# EAGLE design metercam (EAGLE 9.6.2)
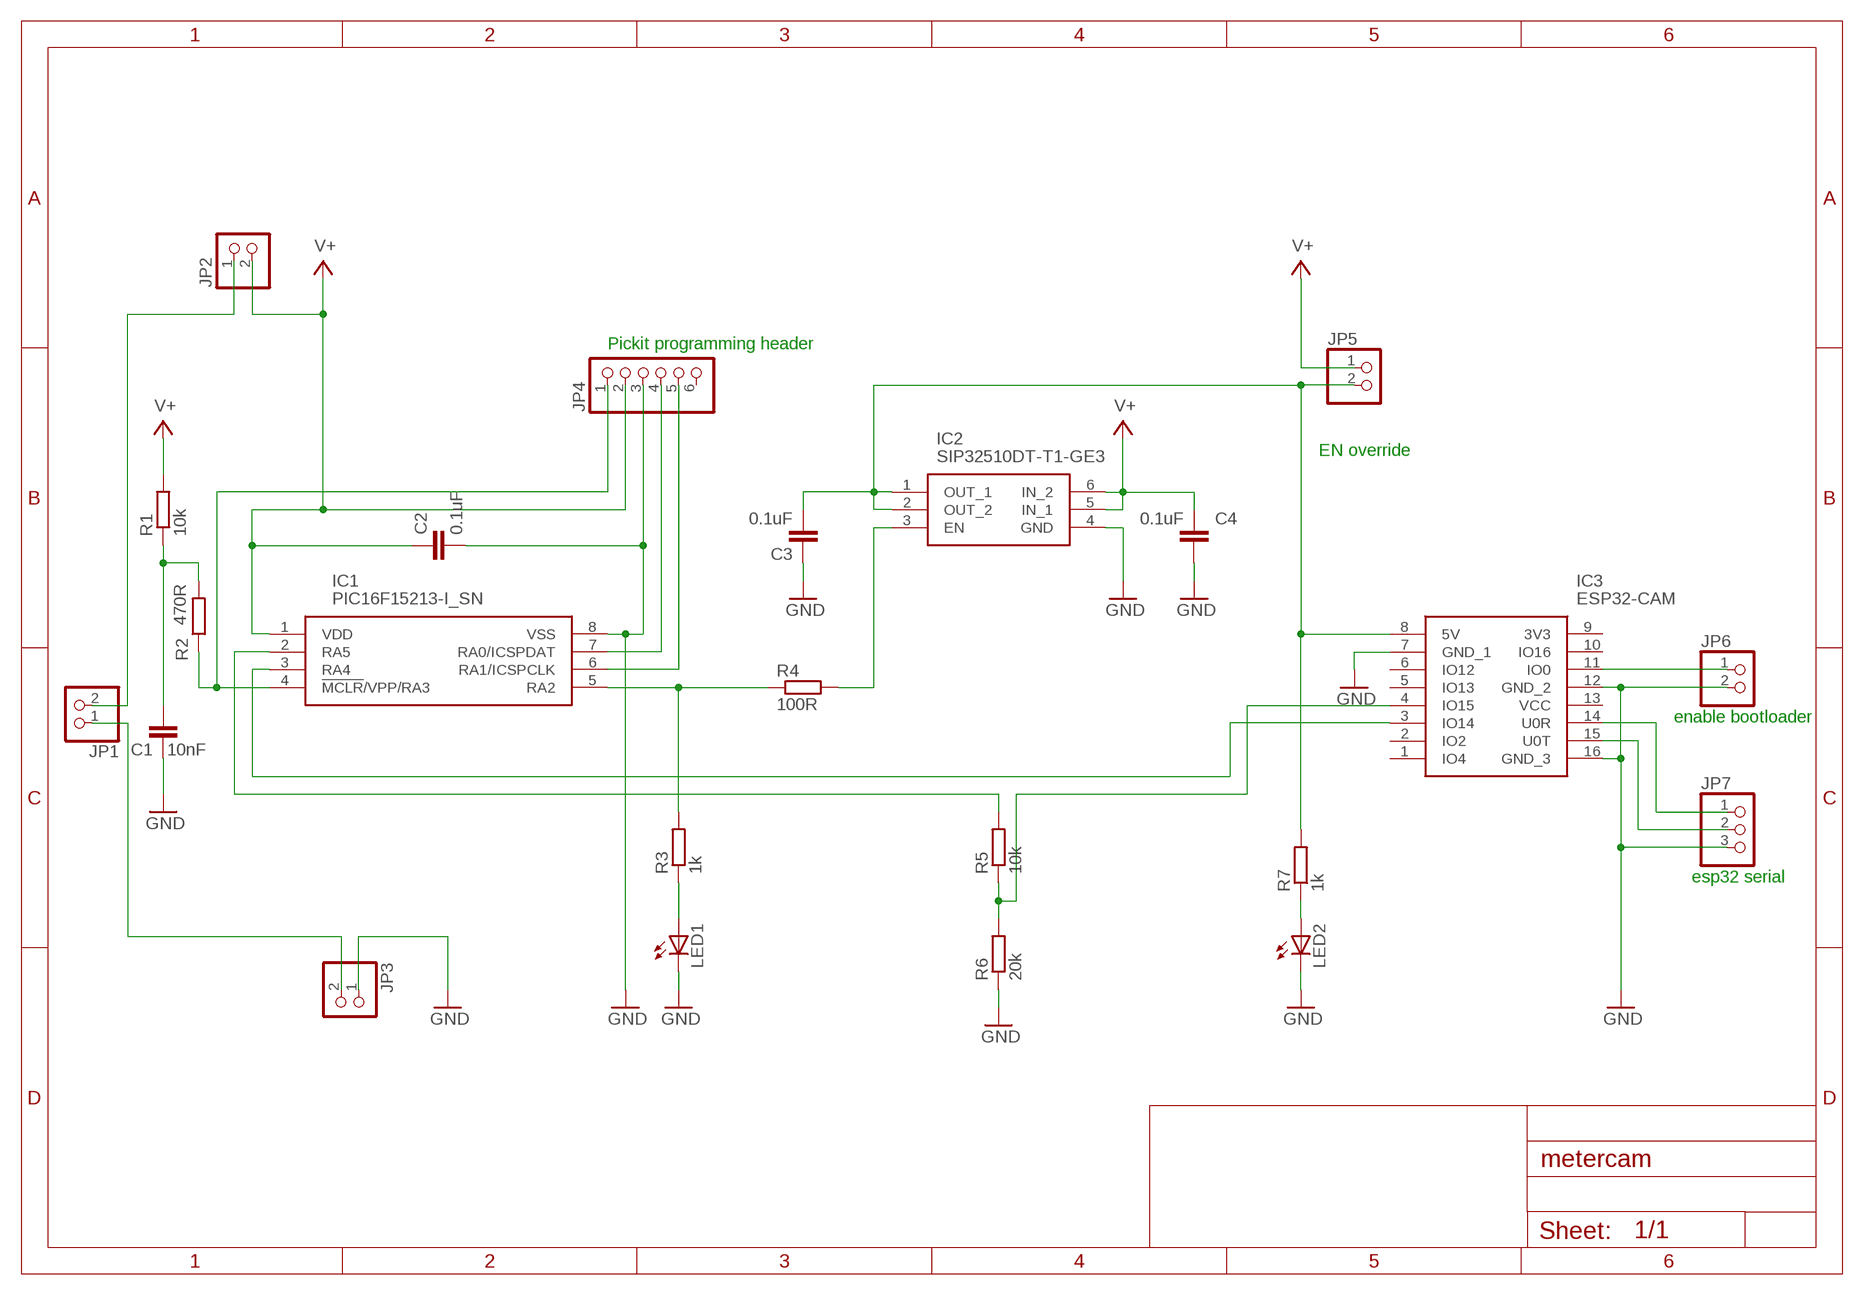
[diagram p0: schematic, sheet 1]

## Parts
C1  10nF  C-EUC0805  [C0805]
C2  0.1uF  C-EUC0805  [C0805]
C3  0.1uF  C-EUC0805  [C0805]
C4  0.1uF  C-EUC0805  [C0805]
IC1  PIC16F15213-I_SN  [SOIC127P600X175-8N]
IC2  SIP32510DT-T1-GE3  [SOT95P284X110-6N]
IC3  ESP32-CAM  [ESP32CAM]
JP1  PINHD-1X2  [1X02]
JP2  PINHD-1X2  [1X02]
JP3  PINHD-1X2  [1X02]
JP4  PINHD-1X6  [1X06]
JP5  PINHD-1X2  [1X02]
JP6  PINHD-1X2  [1X02]
JP7  PINHD-1X3  [1X03]
LED1  LEDSML0805  [SML0805]
LED2  LEDSML0805  [SML0805]
R1  10k  R-EU_R0805  [R0805]
R2  470R  R-EU_R0805  [R0805]
R3  1k  R-EU_R0805  [R0805]
R4  100R  R-EU_R0805  [R0805]
R5  10k  R-EU_R0805  [R0805]
R6  20k  R-EU_R0805  [R0805]
R7  1k  R-EU_R0805  [R0805]

## Nets
GND: C1.1 C2.2 C3.1 C4.1 IC1.8(VSS) IC2.4(GND) IC3.7(GND_1) IC3.12(GND_2) IC3.16(GND_3) JP3.1 JP4.3 JP6.2 JP7.3 LED1.C LED2.C R6.1
N$1: IC1.4(!MCLR!/VPP/RA3) JP4.1 R2.1
N$2: IC3.14(U0R) JP7.1
N$3: JP1.2 JP2.1
N$4: IC1.7(RA0/ICSPDAT) JP4.4
N$5: IC1.6(RA1/ICSPCLK) JP4.5
N$6: IC3.11(IO0) JP6.1
N$7: JP1.1 JP3.2
N$8: IC3.15(U0T) JP7.2
N$9: IC1.5(RA2) R3.2 R4.1
N$10: IC2.3(EN) R4.2
N$11: C3.2 IC2.1(OUT_1) IC2.2(OUT_2) IC3.8(5V) JP5.2 R7.2
N$12: LED2.A R7.1
N$13: LED1.A R3.1
N$14: IC1.3(RA4) IC3.3(IO14)
N$15: IC1.2(RA5) R5.2
N$16: IC3.4(IO15) R5.1 R6.2
N$17: C1.2 R1.1 R2.2
V+: C2.1 C4.2 IC1.1(VDD) IC2.5(IN_1) IC2.6(IN_2) JP2.2 JP4.2 JP5.1 R1.2
Unconnected: IC3.1(IO4) IC3.2(IO2) IC3.5(IO13) IC3.6(IO12) IC3.9(3V3) IC3.10(IO16) IC3.13(VCC) JP4.6

## Notes on the sheet
- Pickit programming header
- EN override
- enable bootloader
- esp32 serial

## Library data of the parts
C1-C4 = rcl:C-EU: CAPACITOR, European symbol
IC1 = SamacSys_Parts:PIC16F15213-I_SN: 8-bit Microcontrollers - MCU Source: Datasheet <https://ww1.microchip.com/downloads/en/DeviceDoc/PIC16F15213-14-23-24-43-44-Data-Sheet-DS40002195B.pdf>; DESCRIPTION: 8-bit Microcontrollers - MCU; HEIGHT: 1.75mm; MANUFACTURER_NAME: Microchip; MANUFACTURER_PART_NUMBER: PIC16F15213-I/SN; MOUSER_PART_NUMBER: 579-PIC16F15213-I/SN; MOUSER_PRICE-STOCK: https://www.mouser.co.uk/ProductDetail/Microchip-Technology/PIC16F15213-I-SN/?qs=xZ%2FP%252Ba9zWqYiVkzeoDlM6Q%3D%3D
IC2 = SamacSys_Parts:SIP32510DT-T1-GE3: VISHAY - SIP32510DT-T1-GE3 - IC, LOAD SWITCH, 1.1V-5.5V, 3A, TSOT-23 Source: Datasheet <http://www.vishay.com/docs/63577/sip32510.pdf>; DESCRIPTION: VISHAY - SIP32510DT-T1-GE3 - IC, LOAD SWITCH, 1.1V-5.5V, 3A, TSOT-23; HEIGHT: 1.1mm; MANUFACTURER_NAME: Vishay; MANUFACTURER_PART_NUMBER: SIP32510DT-T1-GE3; MOUSER_PART_NUMBER: 78-SIP32510DT-T1-GE3; MOUSER_PRICE-STOCK: https://www.mouser.co.uk/ProductDetail/Vishay-Siliconix/SIP32510DT-T1-GE3?qs=vCSEJkzpMViCK9YFQ975Xw%3D%3D
IC3 = ESP32-CAM:ESP32-CAM: Modules PCBA Module RoHS Source: Datasheet <https://datasheet.lcsc.com/szlcsc/Ai-Thinker-ESP32-CAM_C277946.pdf>; DESCRIPTION: Modules PCBA Module RoHS; HEIGHT: 5mm; MANUFACTURER_NAME: Ai-Thinker; MANUFACTURER_PART_NUMBER: ESP32-CAM
JP1-JP3 JP5 JP6 = pinhead:PINHD-1X2: PIN HEADER
JP4 = pinhead:PINHD-1X6: PIN HEADER
JP7 = pinhead:PINHD-1X3: PIN HEADER
LED1 LED2 = led:LED: LED OSRAM: - CHIPLED LG R971, LG N971, LY N971, LG Q971, LY Q971, LO R971, LY R971 LH N974, LH R974 LS Q976, LO Q976, LY Q976 LO Q996 - Hyper CHIPLED LW Q18S LB Q993, LB Q99A, LB R99A - SideLED LS A670, LO A670, LY A670, LG A670, LP A670 LB A673, LV A673, LT A673, LW A673 LH A674 LY A675 LS A676, LA A676, LO A676, LY A676, LW A676 LS A679, LY A679, LG A679 - Hyper Micro SIDELED® LS Y876, LA Y876, LO Y876, LY Y876 LT Y87S - SmartLED LW L88C, LW L88S LB L89C, LB L89S, LG L890 LS L89K, LO L89K, LY L89K LS L896, LA L896, LO L896, LY L896 - TOPLED LS T670, LO T670, LY T670, LG T670, LP T670 LSG T670, LSP T670, LSY T670, LOP T670, LYG T670 LG T671, LOG T671, LSG T671 LB T673, LV T673, LT T673, LW T673 LH T674 LS T676, LA T676, LO T676, LY T676, LB T676, LH T676, LSB T676, LW T676 LB T67C, LV T67C, LT T67C, LS T67K, LO T67K, LY T67K, LW E67C LS E67B, LA E67B, LO E67B, LY E67B, LB E67C, LV E67C, LT E67C LW T67C LS T679, LY T679, LG T679 LS T770, LO T770, LY T770, LG T770, LP T770 LB T773, LV T773, LT T773, LW T773 LH T774 LS E675, LA E675, LY E675, LS T675 LS T776, LA T776, LO T776, LY T776, LB T776 LHGB T686 LT T68C, LB T68C - Hyper Mini TOPLED® LB M676 - Mini TOPLED Santana® LG M470 LS M47K, LO M47K, LY M47K Source: http://www.osram.convergy.de LUXEON: - LUMILED® LXK2-PW12-R00, LXK2-PW12-S00, LXK2-PW14-U00, LXK2-PW14-V00 LXK2-PM12-R00, LXK2-PM12-S00, LXK2-PM14-U00 LXK2-PE12-Q00, LXK2-PE12-R00, LXK2-PE12-S00, LXK2-PE14-T00, LXK2-PE14-U00 LXK2-PB12-K00, LXK2-PB12-L00, LXK2-PB12-M00, LXK2-PB14-N00, LXK2-PB14-P00, LXK2-PB14-Q00 LXK2-PR12-L00, LXK2-PR12-M00, LXK2-PR14-Q00, LXK2-PR14-R00 LXK2-PD12-Q00, LXK2-PD12-R00, LXK2-PD12-S00 LXK2-PH12-R00, LXK2-PH12-S00 LXK2-PL12-P00, LXK2-PL12-Q00, LXK2-PL12-R00 Source: www.luxeon.com KINGBRIGHT: KA-3528ASYC Source: www.kingbright.com
R1-R7 = resistor:R-EU_: RESISTOR, European symbol

## Board
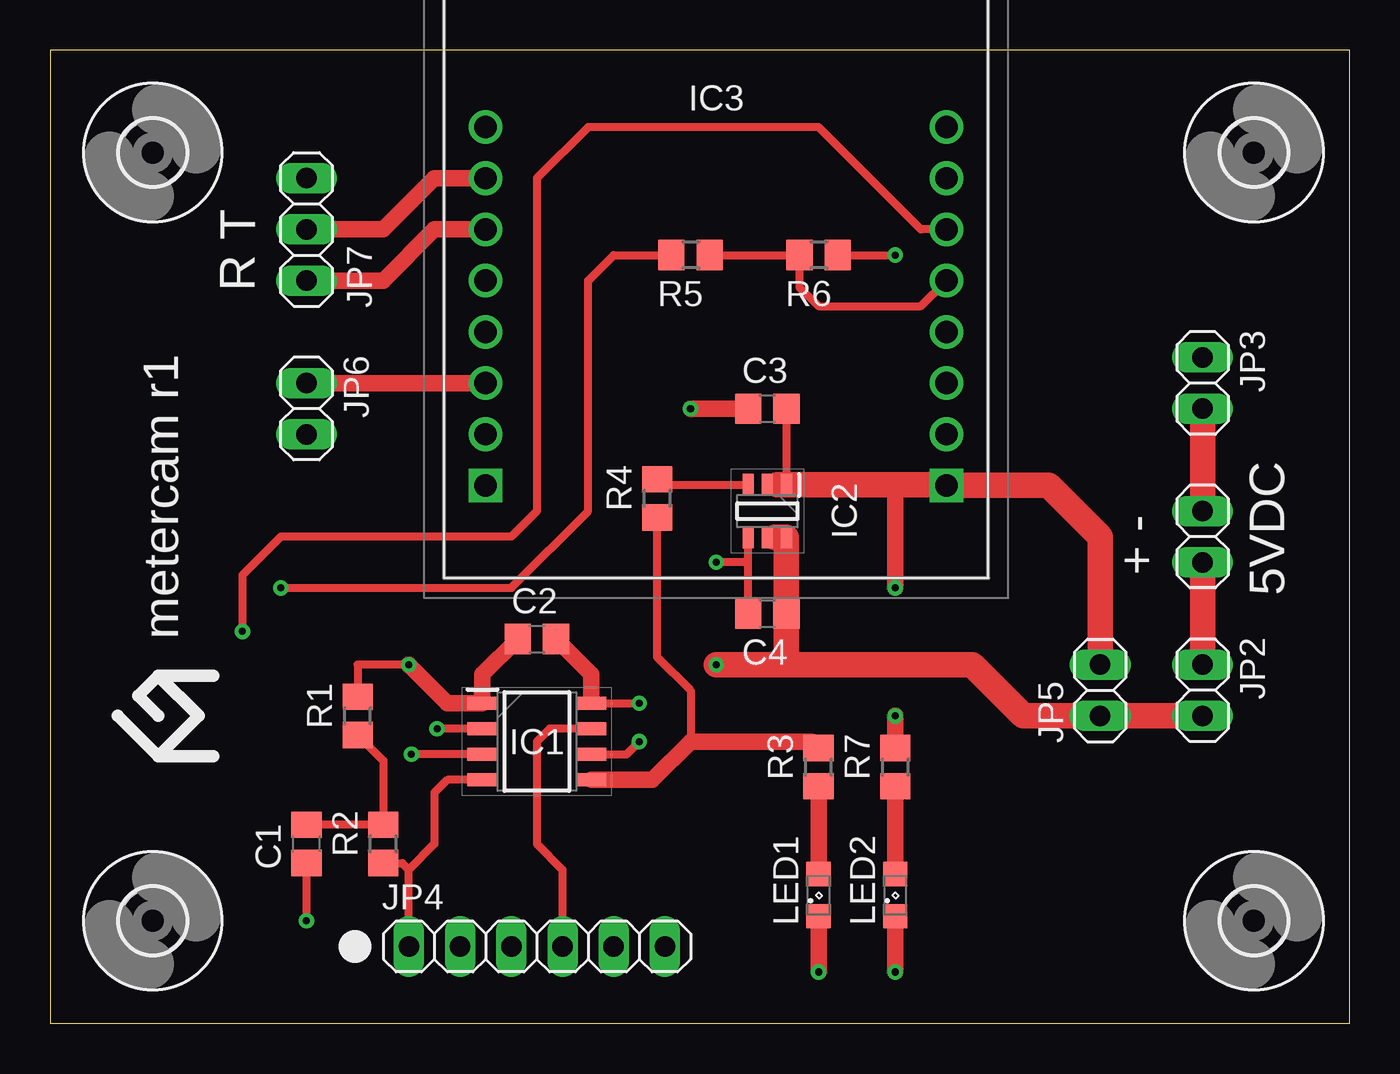
[diagram p1: board, top side]
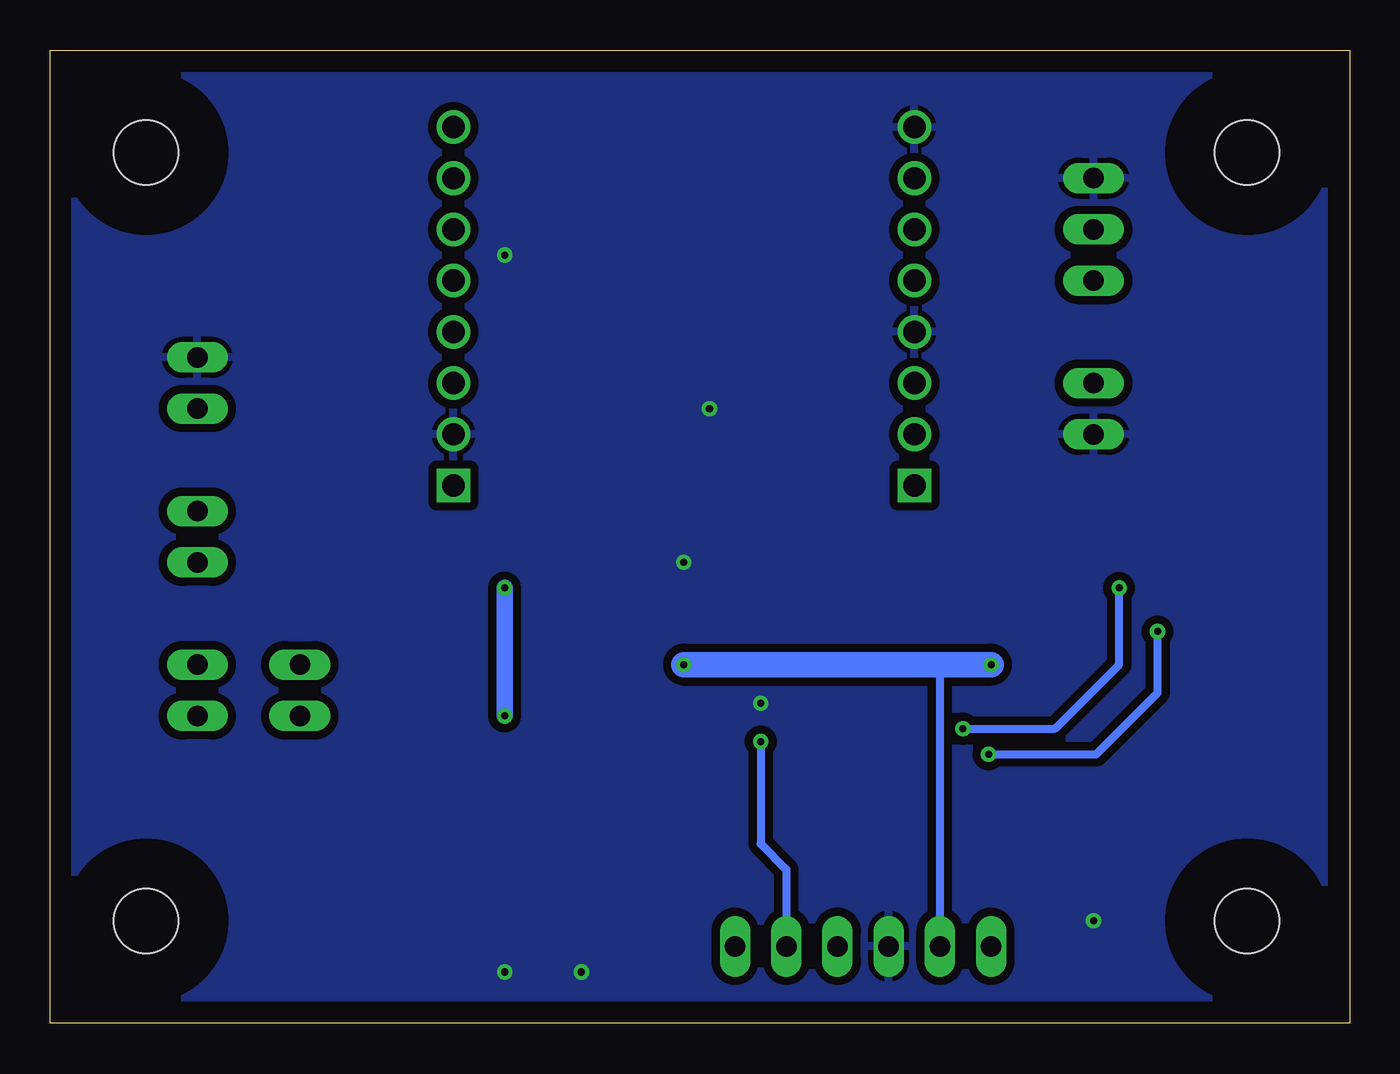
[diagram p2: board, bottom side, seen from below]

Size 64.44 x 48.25 mm. Coordinates in mm from the lower left corner, seen from the top.
Outline: 0,0 64.44,0 64.44,48.25 0,48.25 0,0
Copper layers (1*16): Top 0.035mm / dielectric 1.5mm / Bottom 0.035mm
Design rules "default *": minimum track width 6mil, minimum drill 0.35mm, track to track 16mil, track to pad 16mil, pad to pad 16mil, via to via 16mil, smd to smd 16mil, copper to edge 40mil, drill to drill 6mil, minimum pad ring 10mil, minimum via ring 8mil, stop-mask expansion 4mil, vias tented up to drill 0mil, thermal gap 10mil

### Footprints (pad centres in the part's own frame; a part is rotated, then mirrored left to right if it is on the bottom)
C0805 = smd 1.3 x 1.5: 1 -0.95,0; 2 0.95,0
SOIC127P600X175-8N = smd 1.5 x 0.65: 1 -2.7,1.905; 2 -2.7,0.635; 3 -2.7,-0.635; 4 -2.7,-1.905; 5 2.7,-1.905; 6 2.7,-0.635; 7 2.7,0.635; 8 2.7,1.905
SOT95P284X110-6N = smd 1.1 x 0.55: 1 -1.3,0.95; 2 -1.3,0; 3 -1.3,-0.95; 4 1.3,-0.95; 5 1.3,0; 6 1.3,0.95
ESP32CAM = drill 1.11 pad 1.665: 1 0,0; 2 0,2.54; 3 0,5.08; 4 0,7.62; 5 0,10.16; 6 0,12.7; 7 0,15.24; 10 22.86,15.24; 11 22.86,12.7; 12 22.86,10.16; 13 22.86,7.62; 14 22.86,5.08; 15 22.86,2.54; 16 22.86,0 | drill 1.11 pad 1.665 square: 8 0,17.78; 9 22.86,17.78
1X02 = drill 1.016 long: 1 -1.27,0; 2 1.27,0
1X06 = drill 1.016 long: 1 -6.35,0; 2 -3.81,0; 3 -1.27,0; 4 1.27,0; 5 3.81,0; 6 6.35,0
1X03 = drill 1.016 long: 1 -2.54,0; 2 0,0; 3 2.54,0
SML0805 = smd 1.2 x 1.2: A 1.05,0; C -1.05,0
R0805 = smd 1.3 x 1.5: 1 -0.95,0; 2 0.95,0
3,2 = hole 3.2: 0,0

### Placement (x,y rotation side)
C1  12.7,8.89 90 top
C2  24.13,19.05 0 top
C3  35.56,30.48 0 top
C4  35.56,20.32 0 top
IC1  24.13,13.97 0 top
IC2  35.56,25.4 270 top
IC3  44.45,44.45 180 top
JP1  57.15,24.13 270 top
JP2  57.15,16.51 270 top
JP3  57.15,31.75 270 top
JP4  24.13,3.81 0 top
JP5  52.07,16.51 90 top
JP6  12.7,30.48 270 top
JP7  12.7,39.37 90 top
LED1  38.1,6.35 90 top
LED2  41.91,6.35 90 top
R1  15.24,15.24 90 top
R2  16.51,8.89 90 top
R3  38.1,12.7 90 top
R4  30.1,26.03 90 top
R5  31.75,38.1 180 top
R6  38.1,38.1 180 top
R7  41.91,12.7 90 top
U$1  [3,2]  5.08,43.18 0 top
U$2  [3,2]  59.69,43.18 0 top
U$3  [3,2]  59.69,5.08 0 top
U$4  [3,2]  5.08,5.08 0 top

### Tracks (layer width: path | path; a pad name or v marks a point on that pad's centre or on a via)
GND  (via drill 0.35)
  Top 0.406: C4.1 34.61,22.86 | 34.61,22.86 IC2.4 | v29.21,15.88 IC1.8 26.83,16 | C1.1 v12.7,5.08 | 34.61,22.86 v33.02,22.86 | R6.1 v41.91,38.1
  Top 0.813: C2.2 26.83,17.3 26.83,16 | C3.1 v31.75,30.48 | LED2.C v41.91,2.54 | LED1.C v38.1,2.54
  pour Bottom: 1.27,46.99 1.27,1.27 63.5,1.27 63.5,46.99
N$1
  Top 0.406: JP4.1 17.78,7.62 | R2.1 17.46,7.94 17.78,7.62 | IC1.4 19.69,12.06 19.05,11.43 19.05,8.89 17.78,7.62
N$2
  Top 0.813: JP7.1 16.51,36.83 19.05,39.37 IC3.14
N$3
  Top 1.27: JP1.2 JP2.1
N$4
  Top 0.406: IC1.7 24.77,14.6 24.13,13.97 24.13,8.89 25.4,7.62 JP4.4
N$5  (via drill 0.35)
  Top 0.406: IC1.6 28.58,13.34 v29.21,13.97
  Bottom 0.406: v29.21,13.97 29.21,8.89 27.94,7.62 JP4.5
N$6
  Top 0.813: JP6.1 IC3.11
N$7
  Top 1.27: JP1.1 JP3.2
N$8
  Top 0.813: JP7.2 16.51,39.37 19.05,41.91 IC3.15
N$9
  Top 0.406: 31.75,13.97 31.75,16.51 30.1,18.16 R4.1
  Top 0.813: IC1.5 29.84,12.06 31.75,13.97 37.78,13.97 R3.2
N$10
  Top 0.406: R4.2 30.38,26.7 IC2.3
N$11  (via drill 0.35)
  Top 0.406: C3.2 IC2.1 IC2.2 36.05,26.7
  Top 0.813: R7.2 v41.91,15.24 | v41.91,21.59 41.91,26.7
  Top 1.27: JP5.2 52.07,24.13 49.53,26.67 IC3.8 44.42,26.7 41.91,26.7 36.05,26.7
  Bottom 0.813: v41.91,15.24 v41.91,21.59
N$12
  Top 0.813: R7.1 LED2.A
N$13
  Top 0.813: R3.1 LED1.A
N$14  (via drill 0.35)
  Top 0.406: IC1.3 v17.91,13.34 | IC3.3 43.18,39.37 38.1,44.45 26.67,44.45 24.13,41.91 24.13,25.4 22.86,24.13 11.43,24.13 9.52,22.23 v9.52,19.43
  Bottom 0.406: v17.91,13.34 12.57,13.34 9.52,16.38 v9.52,19.43
N$15  (via drill 0.35)
  Top 0.406: IC1.2 v19.18,14.6 | v11.43,21.59 22.86,21.59 26.67,25.4 26.67,36.83 27.94,38.1 R5.2
  Bottom 0.406: v19.18,14.6 14.6,14.6 11.43,17.78 v11.43,21.59
N$16
  Top 0.406: R5.1 R6.2 37.15,36.51 38.1,35.56 43.18,35.56 IC3.4
N$17
  Top 0.406: R1.1 16.51,13.02 R2.2 C1.2
V+  (via drill 0.35)
  Top 0.406: v17.78,17.78 15.24,17.78 R1.2 | IC2.6 IC2.5
  Top 0.813: v17.78,17.78 19.69,15.88 IC1.1 21.43,17.3 C2.1
  Top 1.27: JP2.2 JP5.1 48.26,15.24 45.72,17.78 36.83,17.78 | 36.83,17.78 v33.02,17.78 | 36.83,17.78 36.51,18.1 C4.2 IC2.6 35.93,24.1
  Bottom 0.406: 20.32,17.78 JP4.2
  Bottom 0.813: v33.02,17.78 20.32,17.78 v17.78,17.78
  Bottom 1.27: v33.02,17.78 v17.78,17.78

### Text on the board
tNames: T | R | + - | 5VDC | metercam r1